# Altium project roneCPUBoard-v13.PrjPCB
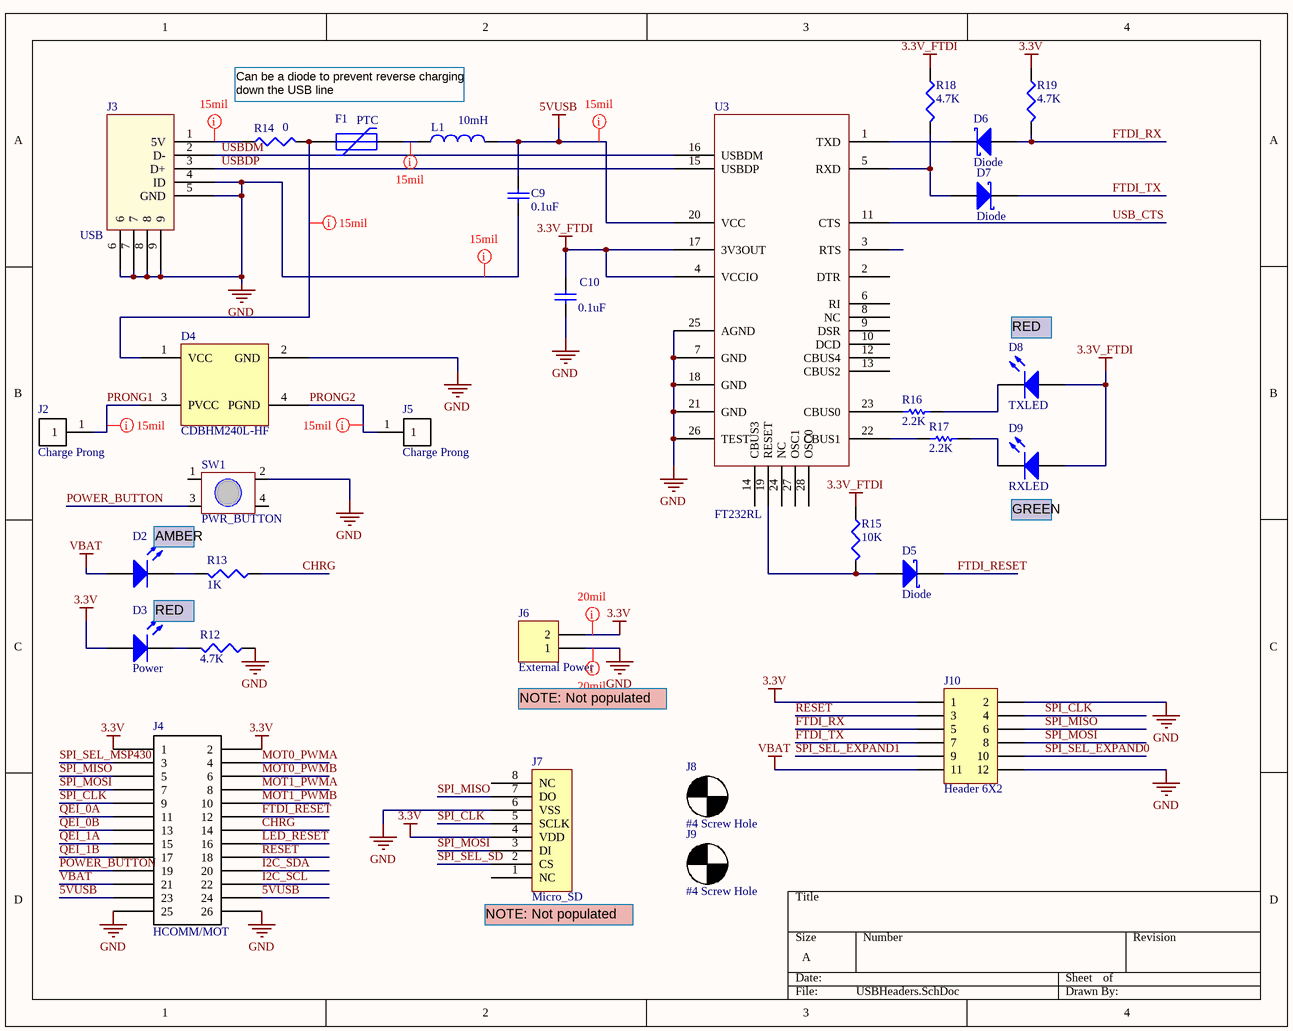
[diagram p0: USBHeaders.SchDoc]
5 sheets, 144 parts. Net scope: global (net labels, ports and power ports of the same name join across sheets).
Board file: roneCPUBoard-v13.PcbDoc
Sheets:
  USBHeaders.SchDoc
  IRComms.SchDoc
  LightSensorsButtons.SchDoc
  Radio.SchDoc
  SoundChip.SchDoc

## Sheet USBHeaders.SchDoc
size A

### Parts
C9  value 0.1uF  [CAPC1005L]
C10  value 0.1uF  [CAPC1005L]
D2  Charge  [SurfaceMount(603)]  (value not drawn)
D3  Power  [SurfaceMount(603)]
D4  CDBHM240L-HF  [DIODEARRAY_2AMPS]
D5  Diode  [SurfaceMount(603)]
D6  Diode  [SurfaceMount(603)]
D7  Diode  [SurfaceMount(603)]
D8  TXLED  [SurfaceMount(603)]
D9  RXLED  [SurfaceMount(603)]
F1  PTC  [ERJ8G-1206]
J2  Charge Prong  [CHARGING_PRONG]
J3  USB  [USB Minib (thru-hole)]
J4  HCOMM/MOT  [HeaderSM 13x2]
J5  Charge Prong  [CHARGING_PRONG]
J6  External Power  [HDR1X2]
J7  Micro_SD  [MICRO_SD]
J8  #4 Screw Hole  [#4_Screw_Hole]
J9  #4 Screw Hole  [#4_Screw_Hole]
J10  Header 6X2  [HDR2X6]
L1  value 10mH  [INDC2012L]  (hidden comment: Inductor)
R12  value 4.7K  [RESC1608L]  (hidden comment: Res3)
R13  value 1K  [RESC1608L]  (hidden comment: Res3)
R14  value 0  [RESC1608L]  (hidden comment: Res3)
R15  value 10K  [RESC1608L]  (hidden comment: Res3)
R16  value 2.2K  [RESC1608L]
R17  value 2.2K  [RESC1608L]
R18  value 4.7K  [RESC1608L]  (hidden comment: Res3)
R19  value 4.7K  [RESC1608L]  (hidden comment: Res3)
SW1  PWR_BUTTON  [SwitchTall-TL330]
U3  FT232RL  [SSOP-28]

### Nets
3.3V: D3.1(A) J4.1 J4.2 J6.2 J7.4(VDD) J10.1 R19.1
3.3V_FTDI: C10.2 D8.1(A) D9.1(A) R15.1 R18.1 U3.4(VCCIO) U3.17(3V3OUT)
5VUSB: C9.2 J4.23 J4.24 L1.2 U3.20(VCC)
GND: C9.1 C10.1 D4.2(GND) J3.4(ID) J3.5(GND) J3.6 J3.7 J3.8 J3.9 J4.25 J4.26 J6.1 J7.6(VSS) J10.2 J10.12 R12.1 SW1.2 U3.7(GND) U3.18(GND) U3.21(GND) U3.25(AGND) U3.26(TEST)
VBAT: D2.1(A) J4.21 J10.11
CHRG: J4.14 R13.1
FTDI_RESET: D5.1(K) J4.12
FTDI_RX: D6.2(A) J10.5 R19.2
FTDI_TX: D7.1(K) J10.7
I2C_SCL: J4.22
I2C_SDA: J4.20
LED_RESET: J4.16
MOT0_PWMA: J4.4
MOT0_PWMB: J4.6
MOT1_PWMA: J4.8
MOT1_PWMB: J4.10
POWER_BUTTON: J4.19 SW1.3
PRONG1: D4.3(PVCC) J2.1
PRONG2: D4.4(PGND) J5.1
QEI_0A: J4.11
QEI_0B: J4.13
QEI_1A: J4.15
QEI_1B: J4.17
RESET: J4.18 J10.3
SPI_CLK: J4.9 J7.5(SCLK) J10.4
SPI_MISO: J4.5 J7.7(DO) J10.6
SPI_MOSI: J4.7 J7.3(DI) J10.8
SPI_SEL_EXPAND0: J10.10
SPI_SEL_EXPAND1: J10.9
SPI_SEL_MSP430: J4.3
SPI_SEL_SD: J7.2(CS)
USB_CTS: U3.11(CTS)
USBDM: J3.2(D-) U3.16(USBDM)
USBDP: J3.3(D+) U3.15(USBDP)
NetD2_2: D2.2(K) R13.2
NetD3_2: D3.2(K) R12.2
NetD4_1: D4.1(VCC) F1.2 R14.2
NetD5_2: D5.2(A) R15.2 U3.19(RESET)
NetD6_1: D6.1(K) U3.1(TXD)
NetD7_2: D7.2(A) R18.2 U3.5(RXD)
NetD8_2: D8.2(K) R16.2
NetD9_2: D9.2(K) R17.2
NetF1_1: F1.1 L1.1
NetJ3_1: J3.1(5V) R14.1
NetR16_1: R16.1 U3.23(CBUS0)
NetR17_1: R17.1 U3.22(CBUS1)

Not connected (* = marked no-connect by the designer): J7 1(NC) 8(NC); SW1 1 4; U3 2(DTR) 3(RTS) 6(RI) 8(NC) 9(DSR) 10(DCD) 12(CBUS4) 13(CBUS2) 14(CBUS3) 24(NC) 27(OSC1) 28(OSC0)

### Layout directives
rule Width Constraint [Pref Width = 15mil    Min Width = 8mil    Max Width = 30mil]: 3.3V
rule Width Constraint [Pref Width = 8mil    Min Width = 8mil    Max Width = 15mil]: 5VUSB, GND, NetJ3_1
rule Width Constraint [Pref Width = 15mil    Min Width = 15mil    Max Width = 20mil]: NetD4_1, NetF1_1
rule Width Constraint [Pref Width = 15mil    Min Width = 8mil    Max Width = 20mil]: PRONG1, PRONG2
rule Width Constraint [Pref Width = 15mil    Min Width = 8mil    Max Width = 100mil]: GND

### Notes on the sheet
- Can be a diode to prevent reverse charging down the USB line
- (near D8) RED
- (near D9) GREEN
- AMBER
- RED
- (near J6) NOTE: Not populated
- (near J7) NOTE: Not populated

### Library data of the parts
C9 C10 = Cap: Capacitor; Published: 8-Jun-2000; LatestRevisionDate: 17-Jul-2002; LatestRevisionNote: Re-released for DXP Platform.; PackageReference: RAD-0.3; Publisher: Altium Limited
D2 D8 D9 = LED2: Typical RED, GREEN, YELLOW, AMBER GaAs LED; Published: 8-Jun-2000; LatestRevisionDate: 17-Jul-2002; LatestRevisionNote: Re-released for DXP Platform.; PackageVersion: Feb-2002; PackageReference: 3.2X1.6X1.1; Publisher: Altium Limited
D3 = LED
D4 = DiodeArray2Amps: MPN: CDBHM240L-HF
D5-D7 = SchottkeyDiode
F1 = PTC_FUSE: Fuse; Published: 8-Jun-2000; LatestRevisionDate: 17-Jul-2002; LatestRevisionNote: Re-released for DXP Platform.; PackageReference: PIN-W2/E2.8; Publisher: Altium Limited
J2 J5 = CHARGE_PRONG: Charging Prong Hole with Plating
J3 = USB-ConnTH
J4 = HCOMM/HMOT: Header, 2X20, 50mil, IDC
J6 = Header 2: Header, 2-Pin; LatestRevisionDate: 17-Jul-2002; LatestRevisionNote: Re-released for DXP Platform.; Publisher: Altium Limited
J8 J9 = Mechanical_Hole: A mechanical hole for mounting the board
J10 = Header 6X2: Header, 6-Pin, Dual row; LatestRevisionDate: 17-Jul-2002; LatestRevisionNote: Re-released for DXP Platform.; Publisher: Altium Limited
L1 = Inductor: Code_IEC: 1005; Published: 8-Jun-2000; LatestRevisionDate: 29-May-2009; LatestRevisionNote: IPC-7351 Footprint Added.; PackageReference: 0402-A; Publisher: Altium Limited; PackageDescription: Chip Inductor; Code_JEITA: 0402
R12-R15 R18 R19 = Res3: Resistor; Published: 8-Jun-2000; LatestRevisionDate: 29-May-2009; LatestRevisionNote: IPC-7351 Footprint Added.; PackageReference: J1-0603; Publisher: Altium Limited; PackageDescription: Chip Resistor
R16 R17 = Res1: Resistor; Published: 8-Jun-2000; LatestRevisionDate: 17-Jul-2002; LatestRevisionNote: Re-released for DXP Platform.; PackageReference: AXIAL-0.3; Publisher: Altium Limited
SW1 = Switch-TL330

## Sheet IRComms.SchDoc
size A
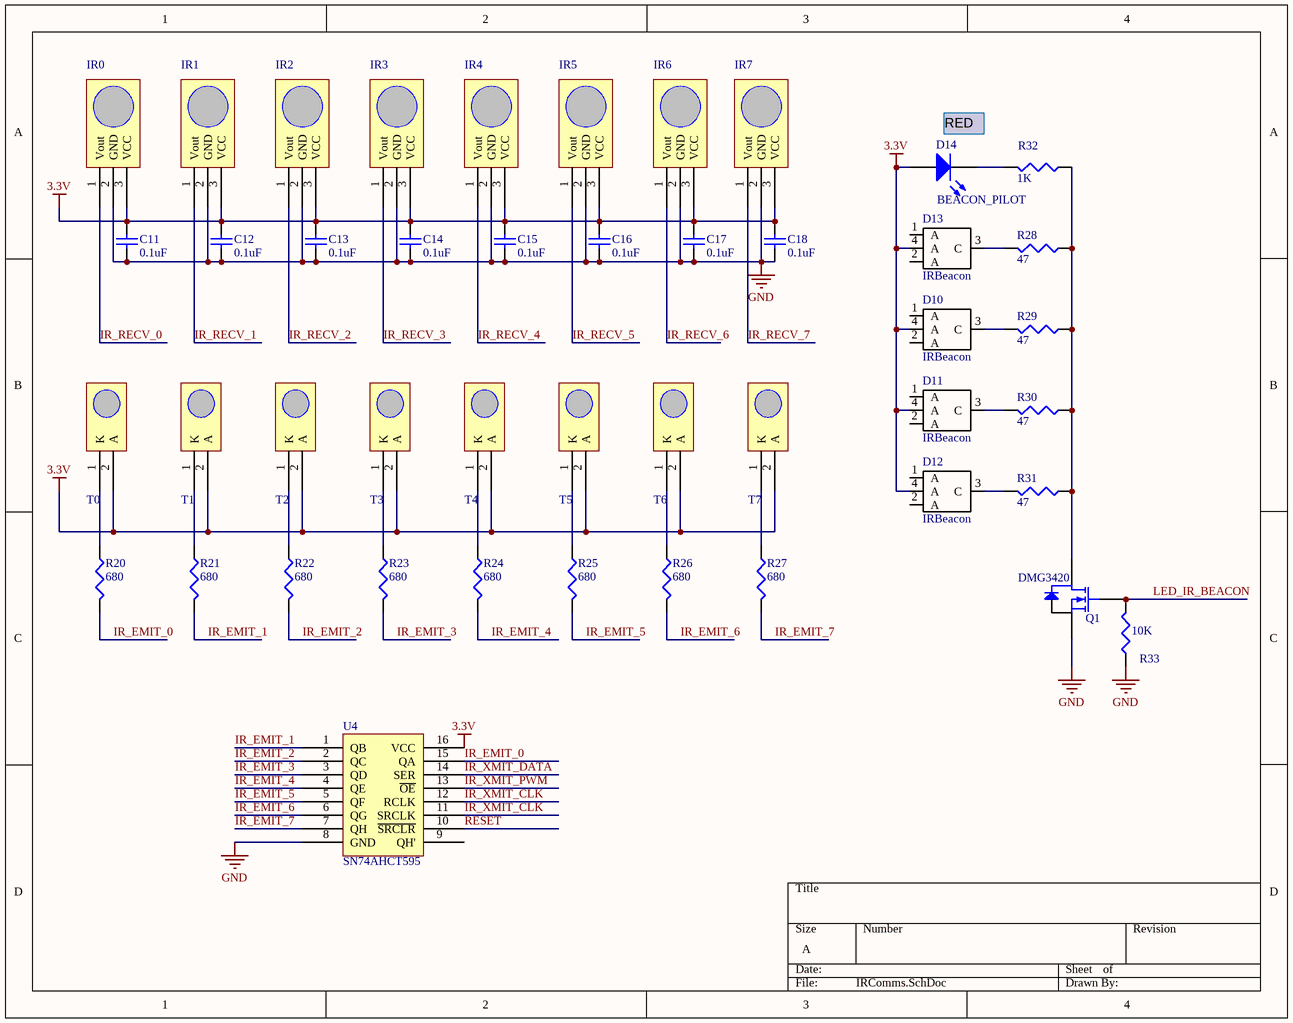
[diagram p1: IRComms.SchDoc]

### Parts
C11  value 0.1uF  [CAPC1005L]  (hidden comment: Cap Semi)
C12  value 0.1uF  [CAPC1005L]  (hidden comment: Cap Semi)
C13  value 0.1uF  [CAPC1005L]  (hidden comment: Cap Semi)
C14  value 0.1uF  [CAPC1005L]  (hidden comment: Cap Semi)
C15  value 0.1uF  [CAPC1005L]  (hidden comment: Cap Semi)
C16  value 0.1uF  [CAPC1005L]  (hidden comment: Cap Semi)
C17  value 0.1uF  [CAPC1005L]  (hidden comment: Cap Semi)
C18  value 0.1uF  [CAPC1005L]  (hidden comment: Cap Semi)
D10  IRBeacon  [IRBeacon]
D11  IRBeacon  [IRBeacon]
D12  IRBeacon  [IRBeacon]
D13  IRBeacon  [IRBeacon]
D14  BEACON_PILOT  [SurfaceMount(603)]
IR0  GP1UX31QS  [GP1UX31QS]  (value not drawn)
IR1  GP1UX31QS  [GP1UX31QS]  (value not drawn)
IR2  GP1UX31QS  [GP1UX31QS]  (value not drawn)
IR3  GP1UX31QS  [GP1UX31QS]  (value not drawn)
IR4  GP1UX31QS  [GP1UX31QS]  (value not drawn)
IR5  GP1UX31QS  [GP1UX31QS]  (value not drawn)
IR6  GP1UX31QS  [GP1UX31QS]  (value not drawn)
IR7  GP1UX31QS  [GP1UX31QS]  (value not drawn)
Q1  MPN: DMG3420  [SOT-23]  (hidden comment: Mosfet)
R20  value 680  [RESC1608L]  (hidden comment: Res3)
R21  value 680  [RESC1608L]  (hidden comment: Res3)
R22  value 680  [RESC1608L]  (hidden comment: Res3)
R23  value 680  [RESC1608L]  (hidden comment: Res3)
R24  value 680  [RESC1608L]  (hidden comment: Res3)
R25  value 680  [RESC1608L]  (hidden comment: Res3)
R26  value 680  [RESC1608L]  (hidden comment: Res3)
R27  value 680  [RESC1608L]  (hidden comment: Res3)
R28  value 47  [RESC1608L]  (hidden comment: Res3)
R29  value 47  [RESC1608L]  (hidden comment: Res3)
R30  value 47  [RESC1608L]  (hidden comment: Res3)
R31  value 47  [RESC1608L]  (hidden comment: Res3)
R32  value 1K  [RESC1608L]  (hidden comment: Res3)
R33  value 10K  [RESC1608L]  (hidden comment: Res3)
T0  LN54  [LN54]  (value not drawn)
T1  LN54  [LN54]  (value not drawn)
T2  LN54  [LN54]  (value not drawn)
T3  LN54  [LN54]  (value not drawn)
T4  LN54  [LN54]  (value not drawn)
T5  LN54  [LN54]  (value not drawn)
T6  LN54  [LN54]  (value not drawn)
T7  LN54  [LN54]  (value not drawn)
U4  SN74AHCT595  [TSSOP-16]

### Nets
3.3V: C11.2 C12.2 C13.2 C14.2 C15.2 C16.2 C17.2 C18.2 D10.4(A) D11.4(A) D12.4(A) D13.4(A) D14.1(A) IR0.3(VCC) IR1.3(VCC) IR2.3(VCC) IR3.3(VCC) IR4.3(VCC) IR5.3(VCC) IR6.3(VCC) IR7.3(VCC) T0.2(A) T1.2(A) T2.2(A) T3.2(A) T4.2(A) T5.2(A) T6.2(A) T7.2(A) U4.16(VCC)
GND: C11.1 C12.1 C13.1 C14.1 C15.1 C16.1 C17.1 C18.1 IR0.2(GND) IR1.2(GND) IR2.2(GND) IR3.2(GND) IR4.2(GND) IR5.2(GND) IR6.2(GND) IR7.2(GND) Q1.2(S) R33.1 U4.8(GND)
IR_EMIT_0: R20.2 U4.15(QA)
IR_EMIT_1: R21.2 U4.1(QB)
IR_EMIT_2: R22.2 U4.2(QC)
IR_EMIT_3: R23.2 U4.3(QD)
IR_EMIT_4: R24.2 U4.4(QE)
IR_EMIT_5: R25.2 U4.5(QF)
IR_EMIT_6: R26.2 U4.6(QG)
IR_EMIT_7: R27.2 U4.7(QH)
IR_RECV_0: IR0.1(Vout)
IR_RECV_1: IR1.1(Vout)
IR_RECV_2: IR2.1(Vout)
IR_RECV_3: IR3.1(Vout)
IR_RECV_4: IR4.1(Vout)
IR_RECV_5: IR5.1(Vout)
IR_RECV_6: IR6.1(Vout)
IR_RECV_7: IR7.1(Vout)
IR_XMIT_CLK: U4.11(SRCLK) U4.12(RCLK)
IR_XMIT_DATA: U4.14(SER)
IR_XMIT_PWM: U4.13(~{OE})
LED_IR_BEACON: Q1.1(G) R33.2
RESET: U4.10(~{SRCLR})
NetD10_3: D10.3(C) R29.2
NetD11_3: D11.3(C) R30.2
NetD12_3: D12.3(C) R31.2
NetD13_3: D13.3(C) R28.2
NetD14_2: D14.2(K) R32.2
NetQ1_3: Q1.3(D) R28.1 R29.1 R30.1 R31.1 R32.1
NetR20_1: R20.1 T0.1(K)
NetR21_1: R21.1 T1.1(K)
NetR22_1: R22.1 T2.1(K)
NetR23_1: R23.1 T3.1(K)
NetR24_1: R24.1 T4.1(K)
NetR25_1: R25.1 T5.1(K)
NetR26_1: R26.1 T6.1(K)
NetR27_1: R27.1 T7.1(K)

Not connected (* = marked no-connect by the designer): D10 1(A) 2(A); D11 1(A) 2(A); D12 1(A) 2(A); D13 1(A) 2(A); U4 9(QH')

### Notes on the sheet
- RED

### Library data of the parts
C11-C18 = Cap Semi: Capacitor (Semiconductor SIM Model); Published: 8-Jun-2000; LatestRevisionDate: 29-May-2009; LatestRevisionNote: IPC-7351 Footprint Added.; PackageReference: C1206; Publisher: Altium Limited; PackageDescription: Chip Capacitor
D14 = LED
R20-R33 = Res3: Resistor; Published: 8-Jun-2000; LatestRevisionDate: 29-May-2009; LatestRevisionNote: IPC-7351 Footprint Added.; PackageReference: J1-0603; Publisher: Altium Limited; PackageDescription: Chip Resistor
U4 = SN74AHCT595: shift register

## Sheet LightSensorsButtons.SchDoc
size A
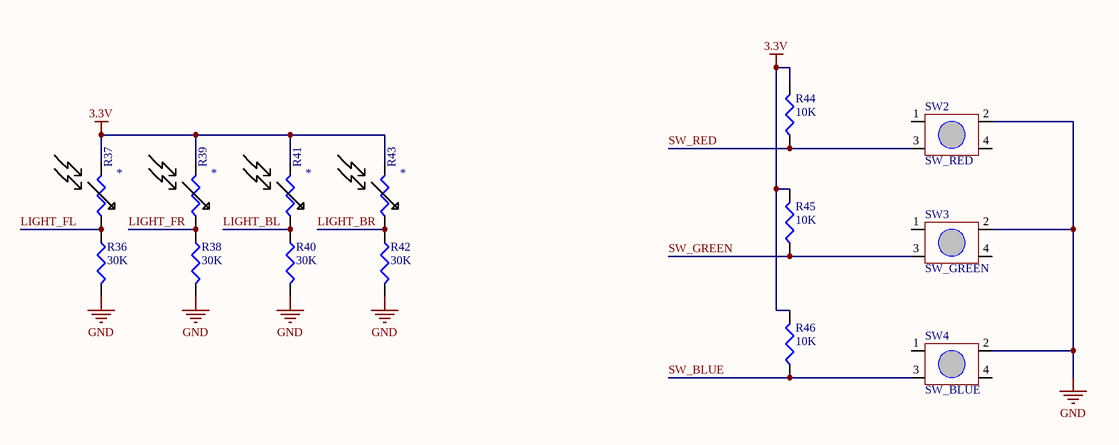
[diagram p2: LightSensorsButtons.SchDoc]

### Parts
R36  value 30K  [RESC1608L]  (hidden comment: Res3)
R37  photoresistor  [photoresistor]  (value not drawn)
R38  value 30K  [RESC1608L]  (hidden comment: Res3)
R39  photoresistor  [photoresistor]  (value not drawn)
R40  value 30K  [RESC1608L]  (hidden comment: Res3)
R41  photoresistor  [photoresistor]  (value not drawn)
R42  value 30K  [RESC1608L]  (hidden comment: Res3)
R43  photoresistor  [photoresistor]  (value not drawn)
R44  value 10K  [RESC1608L]  (hidden comment: Res3)
R45  value 10K  [RESC1608L]  (hidden comment: Res3)
R46  value 10K  [RESC1608L]  (hidden comment: Res3)
SW2  SW_RED  [SwitchTall-TL330]
SW3  SW_GREEN  [SwitchTall-TL330]
SW4  SW_BLUE  [SwitchTall-TL330]

### Nets
3.3V: R37.2 R39.2 R41.2 R43.2 R44.2 R45.2 R46.2
GND: R36.2 R38.2 R40.2 R42.2 SW2.2 SW3.2 SW4.2
LIGHT_BL: R40.1 R41.1
LIGHT_BR: R42.1 R43.1
LIGHT_FL: R36.1 R37.1
LIGHT_FR: R38.1 R39.1
SW_BLUE: R46.1 SW4.3
SW_GREEN: R45.1 SW3.3
SW_RED: R44.1 SW2.3

Not connected (* = marked no-connect by the designer): SW2 1 4; SW3 1 4; SW4 1 4

### Library data of the parts
R36 R38 R40 R42 R44-R46 = Res3: Resistor; Published: 8-Jun-2000; LatestRevisionDate: 29-May-2009; LatestRevisionNote: IPC-7351 Footprint Added.; PackageReference: J1-0603; Publisher: Altium Limited; PackageDescription: Chip Resistor
SW2-SW4 = Switch-TL330
R37 R39 R41 R43 = photoresistor: Value: *

## Sheet Radio.SchDoc
size A
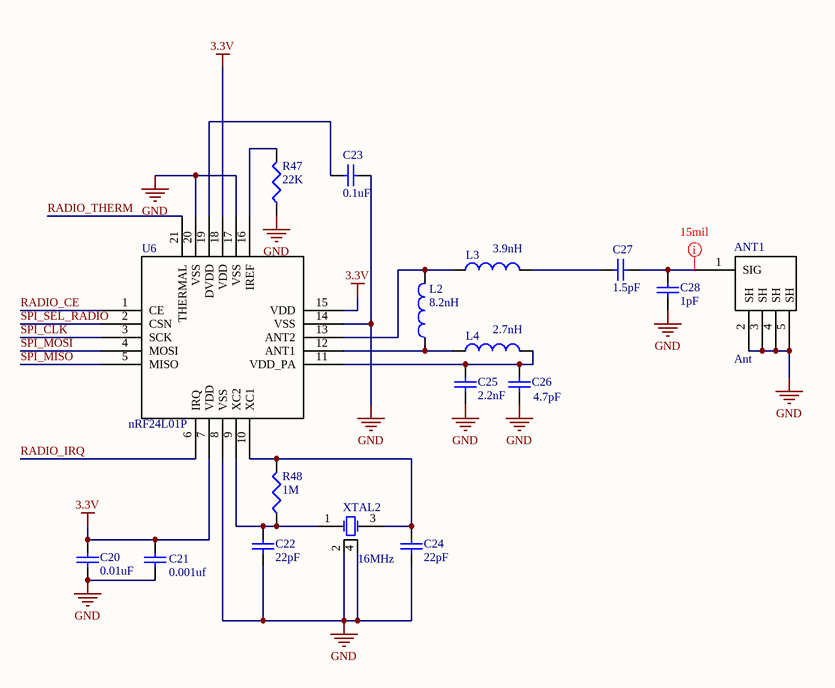
[diagram p3: Radio.SchDoc]

### Parts
ANT1  Ant  [AntennaSMA]
C20  value 0.01uF  [CAPC1005L]  (hidden comment: Cap Semi)
C21  value 0.001uf  [CAPC1005L]  (hidden comment: Cap Semi)
C22  value 22pF  [CAPC1005L]  (hidden comment: Cap Semi)
C23  value 0.1uF  [CAPC1005L]  (hidden comment: Cap Semi)
C24  value 22pF  [CAPC1005L]  (hidden comment: Cap Semi)
C25  value 2.2nF  [CAPC1005L]  (hidden comment: Cap Semi)
C26  value 4.7pF  [CAPC1005L]  (hidden comment: Cap Semi)
C27  value 1.5pF  [CAPC1005L]  (hidden comment: Cap Semi)
C28  value 1pF  [CAPC1005L]  (hidden comment: Cap Semi)
L2  value 8.2nH  [INDC1005AL]  (hidden comment: Inductor)
L3  value 3.9nH  [INDC1005AL]  (hidden comment: Inductor)
L4  value 2.7nH  [INDC1005AL]  (hidden comment: Inductor)
R47  value 22K  [RESC1608L]  (hidden comment: Res3)
R48  value 1M  [RESC1608L]  (hidden comment: Res3)
U6  nRF24L01P  [QFN-20]
XTAL2  16MHz  [CRYSTAL]

### Nets
3.3V: C20.2 C21.2 U6.7(VDD) U6.15(VDD) U6.18(VDD)
GND: ANT1.2(SH) ANT1.3(SH) ANT1.4(SH) ANT1.5(SH) C20.1 C21.1 C22.1 C23.1 C24.1 C25.1 C26.1 C28.1 R47.1 U6.8(VSS) U6.14(VSS) U6.17(VSS) U6.20(VSS) XTAL2.2(GND) XTAL2.4(GND)
RADIO_CE: U6.1(CE)
RADIO_IRQ: U6.6(IRQ)
RADIO_THERM: U6.21(THERMAL)
SPI_CLK: U6.3(SCK)
SPI_MISO: U6.5(MISO)
SPI_MOSI: U6.4(MOSI)
SPI_SEL_RADIO: U6.2(CSN)
NetANT1_1: ANT1.1(SIG) C27.1 C28.2
NetC22_2: C22.2 R48.1 U6.9(XC2) XTAL2.1(OSC1)
NetC23_2: C23.2 U6.19(DVDD)
NetC24_2: C24.2 R48.2 U6.10(XC1) XTAL2.3(OSC2)
NetC25_2: C25.2 C26.2 L4.2 U6.11(VDD_PA)
NetC27_2: C27.2 L3.2
NetL2_1: L2.1 L4.1 U6.12(ANT1)
NetL2_2: L2.2 L3.1 U6.13(ANT2)
NetR47_2: R47.2 U6.16(IREF)

### Layout directives
rule Width Constraint [Pref Width = 15mil    Min Width = 8mil    Max Width = 20mil]: NetANT1_1

### Library data of the parts
ANT1 = AntennaConn
C20-C28 = Cap Semi: Capacitor (Semiconductor SIM Model); Published: 8-Jun-2000; LatestRevisionDate: 29-May-2009; LatestRevisionNote: IPC-7351 Footprint Added.; PackageReference: C1206; Publisher: Altium Limited; PackageDescription: Chip Capacitor
L2-L4 = Inductor: Code_IEC: 1005; Published: 8-Jun-2000; LatestRevisionDate: 29-May-2009; LatestRevisionNote: IPC-7351 Footprint Added.; PackageReference: 0402-A; Publisher: Altium Limited; PackageDescription: Chip Inductor; Code_JEITA: 0402
R47 R48 = Res3: Resistor; Published: 8-Jun-2000; LatestRevisionDate: 29-May-2009; LatestRevisionNote: IPC-7351 Footprint Added.; PackageReference: J1-0603; Publisher: Altium Limited; PackageDescription: Chip Resistor
U6 = radio-nRF24L01P
XTAL2 = Crystal

## Sheet SoundChip.SchDoc
size A
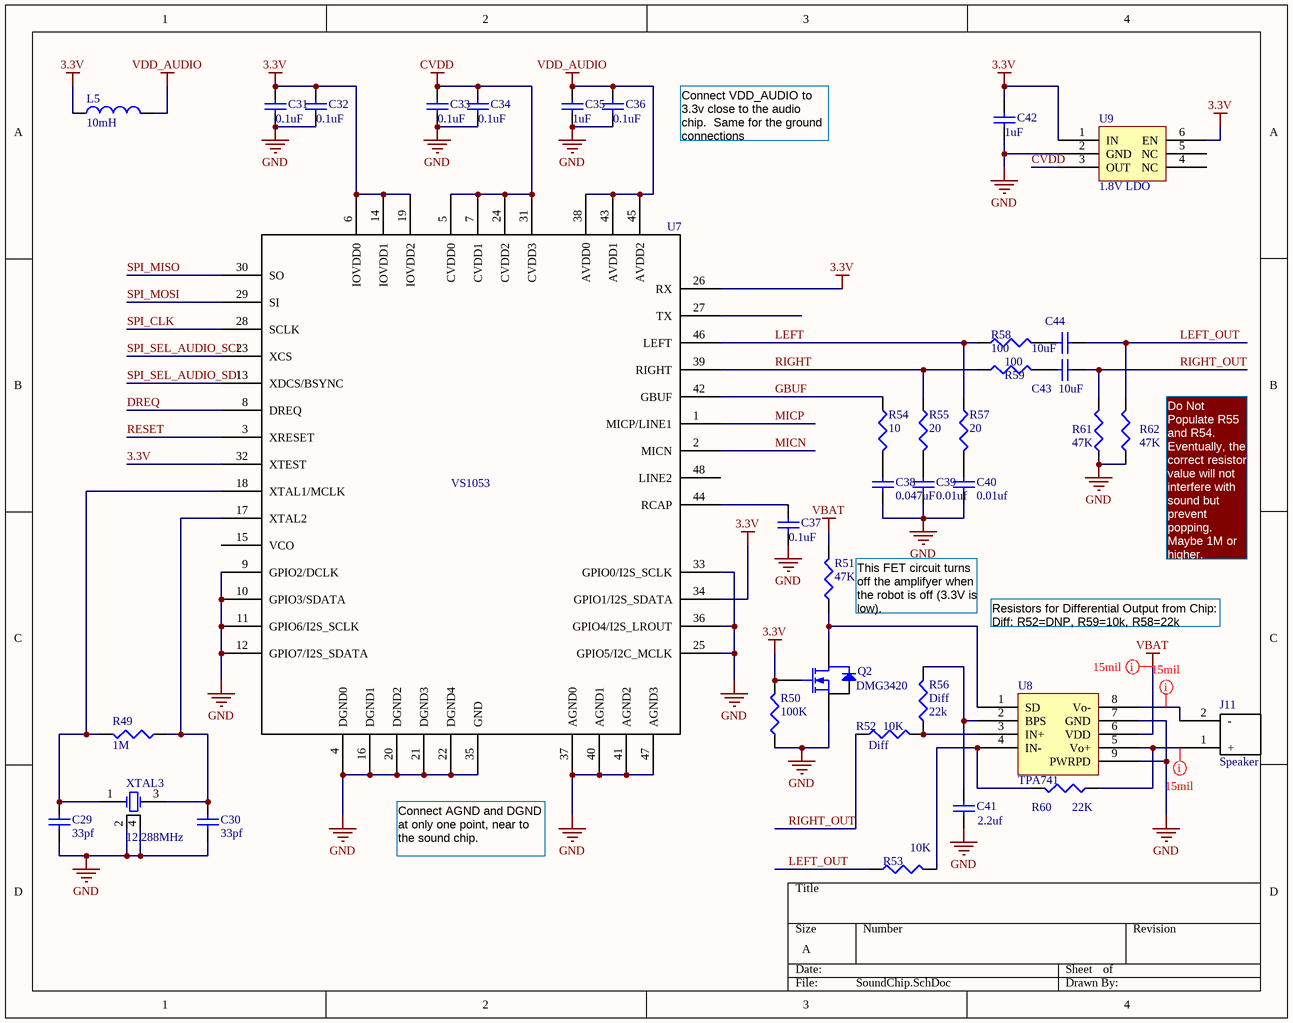
[diagram p4: SoundChip.SchDoc]

### Parts
C29  value 33pf  [CAPC1005L]  (hidden comment: Cap Semi)
C30  value 33pf  [CAPC1005L]  (hidden comment: Cap Semi)
C31  value 0.1uF  [CAPC1005L]  (hidden comment: Cap Semi)
C32  value 0.1uF  [CAPC1005L]  (hidden comment: Cap Semi)
C33  value 0.1uF  [CAPC1005L]  (hidden comment: Cap Semi)
C34  value 0.1uF  [CAPC1005L]  (hidden comment: Cap Semi)
C35  value 1uF  [CAPC1608L]  (hidden comment: Cap Semi)
C36  value 0.1uF  [CAPC1005L]  (hidden comment: Cap Semi)
C37  value 0.1uF  [CAPC1005L]  (hidden comment: Cap Semi)
C38  value 0.047uF  [CAPC1005L]  (hidden comment: Cap Semi)
C39  value 0.01uf  [CAPC1005L]  (hidden comment: Cap Semi)
C40  value 0.01uf  [CAPC1005L]  (hidden comment: Cap Semi)
C41  value 2.2uf  [J1-0603]  (hidden comment: Cap Semi)
C42  value 1uF  [CAPC1608L]  (hidden comment: Cap Semi)
C43  value 10uF  [CAPC1608L]  (hidden comment: Cap Semi)
C44  value 10uF  [CAPC1608L]  (hidden comment: Cap Semi)
J11  Speaker  [BatteryConnJST]
L5  value 10mH  [INDC2012L]  (hidden comment: Inductor)
Q2  MPN: DMG3420  [SOT-23]  (hidden comment: N-Mosfet)
R49  value 1M  [RESC1608L]  (hidden comment: Res3)
R50  value 100K  [RESC1608L]  (hidden comment: Res3)
R51  value 47K  [J1-0603]  (hidden comment: Res3)
R52  Diff  value 10K  [RESC1608L]
R53  value 10K  [RESC1608L]  (hidden comment: Res3)
R54  value 10  [RESC1608L]  (hidden comment: Res3)
R55  value 20  [RESC1608L]  (hidden comment: Res3)
R56  Diff  value 22k  [RESC1608L]
R57  value 20  [RESC1608L]  (hidden comment: Res3)
R58  value 100  [RESC1608L]  (hidden comment: Res3)
R59  value 100  [RESC1608L]  (hidden comment: Res3)
R60  value 22K  [RESC1608L]  (hidden comment: Res3)
R61  value 47K  [RESC1608L]  (hidden comment: Res3)
R62  value 47K  [RESC1608L]  (hidden comment: Res3)
U7  VS1053  [LQFP-48]
U8  TPA741  [audio amp]
U9  1.8V LDO  [WFDFN-6]
XTAL3  12.288MHz  [CRYSTAL]

### Nets
3.3V: C31.2 C32.2 C42.1 L5.2 Q2.1(G) R50.2 U7.6(IOVDD0) U7.14(IOVDD1) U7.19(IOVDD2) U7.26(RX) U7.32(XTEST) U7.34(GPIO1/I2S_SDATA) U9.1(IN) U9.6(EN)
CVDD: C33.2 C34.2 U7.5(CVDD0) U7.7(CVDD1) U7.24(CVDD2) U7.31(CVDD3) U9.3(OUT)
GND: C29.2 C30.2 C31.1 C32.1 C33.1 C34.1 C35.2 C36.1 C37.1 C38.2 C39.2 C40.2 C41.1 C42.2 Q2.2(S) R50.1 R61.1 R62.1 U7.4(DGND0) U7.9(GPIO2/DCLK) U7.10(GPIO3/SDATA) U7.11(GPIO6/I2S_SCLK) U7.12(GPIO7/I2S_SDATA) U7.16(DGND1) U7.20(DGND2) U7.21(DGND3) U7.22(DGND4) U7.25(GPIO5/I2C_MCLK) U7.33(GPIO0/I2S_SCLK) U7.35(GND) U7.36(GPIO4/I2S_LROUT) U7.37(AGND0) U7.40(AGND1) U7.41(AGND2) U7.47(AGND3) U8.7(GND) U8.9(PWRPD) U9.2(GND) XTAL3.2(GND) XTAL3.4(GND)
VBAT: R51.2 U8.6(VDD)
VDD_AUDIO: C35.1 C36.2 L5.1 U7.38(AVDD0) U7.43(AVDD1) U7.45(AVDD2)
DREQ: U7.8(DREQ)
GBUF: R54.1 U7.42(GBUF)
LEFT: R57.1 R58.1 U7.46(LEFT)
LEFT_OUT: C44.1 R53.1 R62.2
MICN: U7.2(MICN)
MICP: U7.1(MICP/LINE1)
RESET: U7.3(XRESET)
RIGHT: R55.1 R59.1 U7.39(RIGHT)
RIGHT_OUT: C43.1 R52.1 R61.2
SPI_CLK: U7.28(SCLK)
SPI_MISO: U7.30(SO)
SPI_MOSI: U7.29(SI)
SPI_SEL_AUDIO_SCI: U7.23(XCS)
SPI_SEL_AUDIO_SDI: U7.13(XDCS/BSYNC)
NetC29_1: C29.1 R49.2 U7.18(XTAL1/MCLK) XTAL3.1(OSC1)
NetC30_1: C30.1 R49.1 U7.17(XTAL2) XTAL3.3(OSC2)
NetC37_2: C37.2 U7.44(RCAP)
NetC38_1: C38.1 R54.2
NetC39_1: C39.1 R55.2
NetC40_1: C40.1 R57.2
NetC41_2: C41.2 R56.2 U8.2(BPS)
NetC43_2: C43.2 R59.2
NetC44_2: C44.2 R58.2
NetJ11_1: J11.1(+) R60.1 U8.5(Vo+)
NetJ11_2: J11.2(-) U8.8(Vo-)
NetQ2_3: Q2.3(D) R51.1 U8.1(SD)
NetR52_2: R52.2 R56.1 U8.3(IN+)
NetR53_2: R53.2 R60.2 U8.4(IN-)

Not connected (* = marked no-connect by the designer): U7 15(VCO) 27(TX) 48(LINE2); U9 4(NC) 5(NC)

### Layout directives
rule Width Constraint [Pref Width = 15mil    Min Width = 8mil    Max Width = 20mil]: NetJ11_1, NetJ11_2, VBAT

### Notes on the sheet
- Connect VDD_AUDIO to 3.3v close to the audio chip.  Same for the ground connections
- (near R62) Do Not Populate R55 and R54. Eventually, the correct resistor value will not interfere with sound but prevent popping. Maybe 1M or higher.
- (near R51) This FET circuit turns off the amplifyer when the robot is off (3.3V is low).
- Resistors for Differential Output from Chip:
  Diff: R52=DNP, R59=10k, R58=22k
- Connect AGND and DGND at only one point, near to the sound chip.

### Library data of the parts
C29-C44 = Cap Semi: Capacitor (Semiconductor SIM Model); Published: 8-Jun-2000; LatestRevisionDate: 29-May-2009; LatestRevisionNote: IPC-7351 Footprint Added.; PackageReference: C1206; Publisher: Altium Limited; PackageDescription: Chip Capacitor
J11 = BatteryConnJST
L5 = Inductor: Code_IEC: 1005; Published: 8-Jun-2000; LatestRevisionDate: 29-May-2009; LatestRevisionNote: IPC-7351 Footprint Added.; PackageReference: 0402-A; Publisher: Altium Limited; PackageDescription: Chip Inductor; Code_JEITA: 0402
R49-R62 = Res3: Resistor; Published: 8-Jun-2000; LatestRevisionDate: 29-May-2009; LatestRevisionNote: IPC-7351 Footprint Added.; PackageReference: J1-0603; Publisher: Altium Limited; PackageDescription: Chip Resistor
U8 = Audio Amp TPA741
U9 = 1.8V_LDO
XTAL3 = Crystal

## Nets that join several sheets
3.3V: USBHeaders (7 pins), IRComms (30 pins), LightSensorsButtons (7 pins), Radio (5 pins), SoundChip (14 pins)
GND: USBHeaders (22 pins), IRComms (19 pins), LightSensorsButtons (7 pins), Radio (19 pins), SoundChip (40 pins)
VBAT: USBHeaders (D2.1 J4.21 J10.11), SoundChip (R51.2 U8.6)
RESET: USBHeaders (J4.18 J10.3), IRComms (U4.10), SoundChip (U7.3)
SPI_CLK: USBHeaders (J4.9 J7.5 J10.4), Radio (U6.3), SoundChip (U7.28)
SPI_MISO: USBHeaders (J4.5 J7.7 J10.6), Radio (U6.5), SoundChip (U7.30)
SPI_MOSI: USBHeaders (J4.7 J7.3 J10.8), Radio (U6.4), SoundChip (U7.29)